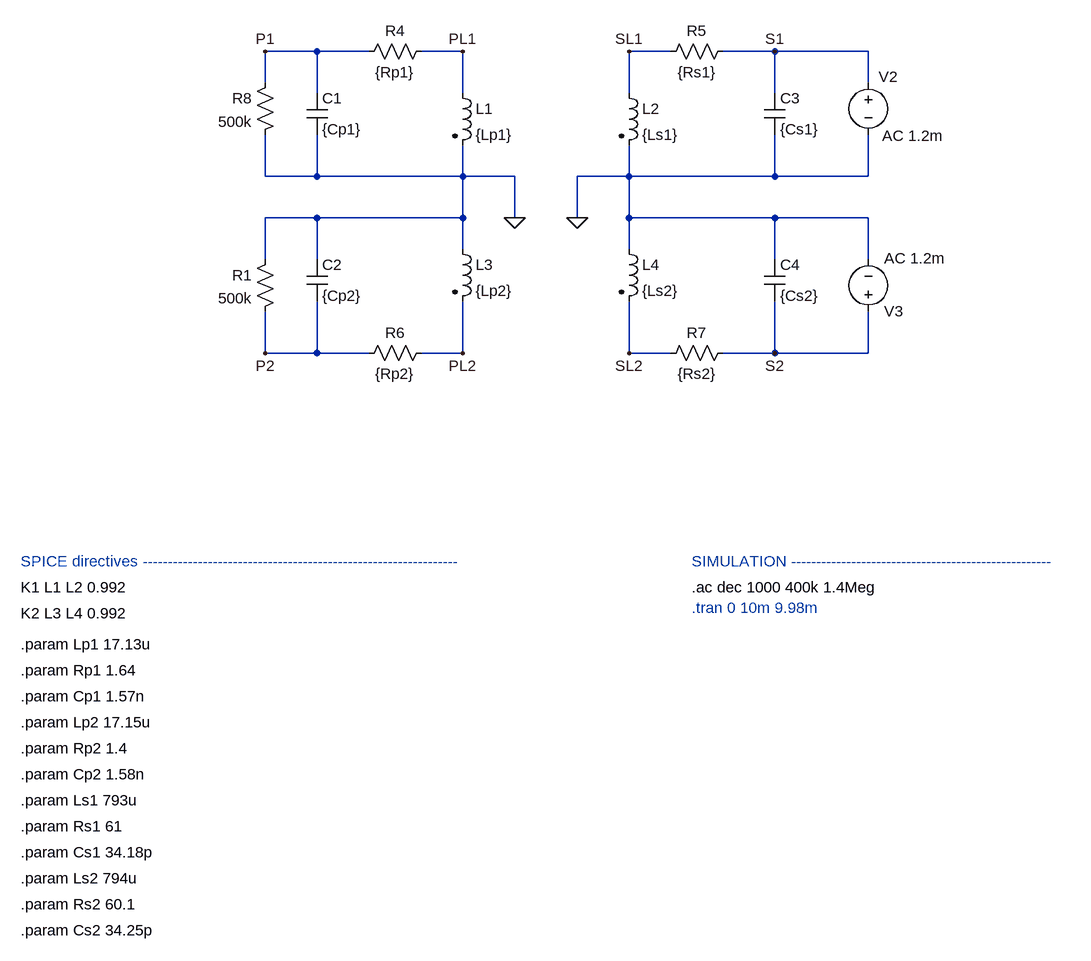
[diagram p0: schematic 1-half_bps_s.asc]
1-half_bps_s.asc, the LTspice schematic file:
Version 4
SHEET 1 1868 1340
WIRE -208 -32 -288 -32
WIRE -128 -32 -208 -32
WIRE 16 -32 -48 -32
WIRE 336 -32 272 -32
WIRE 496 -32 416 -32
WIRE 640 -32 496 -32
WIRE -288 16 -288 -32
WIRE 640 16 640 -32
WIRE -208 32 -208 -32
WIRE 16 32 16 -32
WIRE 272 32 272 -32
WIRE 496 32 496 -32
WIRE -288 160 -288 96
WIRE -208 160 -208 96
WIRE -208 160 -288 160
WIRE 16 160 16 112
WIRE 16 160 -208 160
WIRE 96 160 16 160
WIRE 272 160 272 112
WIRE 272 160 192 160
WIRE 496 160 496 96
WIRE 496 160 272 160
WIRE 640 160 640 96
WIRE 640 160 496 160
WIRE -208 224 -288 224
WIRE 16 224 16 160
WIRE 16 224 -208 224
WIRE 96 224 96 160
WIRE 192 224 192 160
WIRE 272 224 272 160
WIRE 496 224 272 224
WIRE 640 224 496 224
WIRE 16 272 16 224
WIRE 272 272 272 224
WIRE -288 288 -288 224
WIRE -208 288 -208 224
WIRE 496 288 496 224
WIRE 640 288 640 224
WIRE -288 432 -288 368
WIRE -208 432 -208 352
WIRE -208 432 -288 432
WIRE -128 432 -208 432
WIRE 16 432 16 352
WIRE 16 432 -48 432
WIRE 272 432 272 352
WIRE 336 432 272 432
WIRE 496 432 496 352
WIRE 496 432 416 432
WIRE 640 432 640 368
WIRE 640 432 496 432
FLAG 16 -32 PL1
FLAG 272 -32 SL1
FLAG 496 -32 S1
FLAG -288 -32 P1
FLAG 16 432 PL2
FLAG 272 432 SL2
FLAG 496 432 S2
FLAG -288 432 P2
FLAG 96 224 0
FLAG 192 224 0
SYMBOL ind2 0 16 R0
SYMATTR InstName L1
SYMATTR Value {Lp1}
SYMATTR Type ind
SYMBOL ind2 256 16 R0
SYMATTR InstName L2
SYMATTR Value {Ls1}
SYMATTR Type ind
SYMBOL res -32 -48 R90
WINDOW 0 0 56 VBottom 2
WINDOW 3 32 56 VTop 2
SYMATTR InstName R4
SYMATTR Value {Rp1}
SYMBOL res 432 -48 R90
WINDOW 0 0 56 VBottom 2
WINDOW 3 32 56 VTop 2
SYMATTR InstName R5
SYMATTR Value {Rs1}
SYMBOL voltage 640 0 M0
WINDOW 123 -115 98 Left 2
WINDOW 39 0 0 Left 0
WINDOW 0 -45 7 Left 2
SYMATTR Value2 AC 1.2m
SYMATTR InstName V2
SYMATTR Value ""
SYMBOL ind2 0 256 R0
SYMATTR InstName L3
SYMATTR Value {Lp2}
SYMATTR Type ind
SYMBOL ind2 256 256 R0
SYMATTR InstName L4
SYMATTR Value {Ls2}
SYMATTR Type ind
SYMBOL voltage 640 384 M180
WINDOW 123 24 98 Left 2
WINDOW 39 0 0 Left 0
SYMATTR Value2 AC 1.2m
SYMATTR InstName V3
SYMATTR Value ""
SYMBOL res -32 416 R90
WINDOW 0 0 56 VBottom 2
WINDOW 3 32 56 VTop 2
SYMATTR InstName R6
SYMATTR Value {Rp2}
SYMBOL res 432 416 R90
WINDOW 0 0 56 VBottom 2
WINDOW 3 32 56 VTop 2
SYMATTR InstName R7
SYMATTR Value {Rs2}
SYMBOL res -272 0 M0
SYMATTR InstName R8
SYMATTR Value 500k
SYMBOL res -272 272 M0
SYMATTR InstName R1
SYMATTR Value 500k
SYMBOL cap -224 32 R0
SYMATTR InstName C1
SYMATTR Value {Cp1}
SYMBOL cap -224 288 R0
SYMATTR InstName C2
SYMATTR Value {Cp2}
SYMBOL cap 480 32 R0
SYMATTR InstName C3
SYMATTR Value {Cs1}
SYMBOL cap 480 288 R0
SYMATTR InstName C4
SYMATTR Value {Cs2}
TEXT -664 752 Left 2 ;SPICE directives ---------------------------------------------------------------
TEXT 368 792 Left 2 !.ac dec 1000 400k 1.4Meg
TEXT 368 752 Left 2 ;SIMULATION ----------------------------------------------------
TEXT 368 824 Left 2 ;.tran 0 10m 9.98m
TEXT -664 792 Left 2 !K1 L1 L2 0.992
TEXT -664 880 Left 2 !.param Lp1 17.13u
TEXT -664 960 Left 2 !.param Cp1 1.57n
TEXT -664 920 Left 2 !.param Rp1 1.64
TEXT -664 1000 Left 2 !.param Lp2 17.15u
TEXT -664 1080 Left 2 !.param Cp2 1.58n
TEXT -664 1040 Left 2 !.param Rp2 1.4
TEXT -664 1120 Left 2 !.param Ls1 793u
TEXT -664 1200 Left 2 !.param Cs1 34.18p
TEXT -664 1160 Left 2 !.param Rs1 61
TEXT -664 1240 Left 2 !.param Ls2 794u
TEXT -664 1320 Left 2 !.param Cs2 34.25p
TEXT -664 1280 Left 2 !.param Rs2 60.1
TEXT -664 832 Left 2 !K2 L3 L4 0.992

The netlist it stands for:
* 1-half_bps_s.asc
L1 PL1 0 {Lp1}
L2 SL1 0 {Ls1}
R4 PL1 P1 {Rp1}
R5 S1 SL1 {Rs1}
V2 S1 0 AC 1.2m
L3 0 PL2 {Lp2}
L4 0 SL2 {Ls2}
V3 S2 0 AC 1.2m
R6 PL2 P2 {Rp2}
R7 S2 SL2 {Rs2}
R8 P1 0 500k
R1 0 P2 500k
C1 P1 0 {Cp1}
C2 0 P2 {Cp2}
C3 S1 0 {Cs1}
C4 0 S2 {Cs2}
* SPICE directives ---------------------------------------------------------------
.ac dec 1000 400k 1.4Meg
* SIMULATION ----------------------------------------------------
* .tran 0 10m 9.98m
K1 L1 L2 0.992
.param Lp1 17.13u
.param Cp1 1.57n
.param Rp1 1.64
.param Lp2 17.15u
.param Cp2 1.58n
.param Rp2 1.4
.param Ls1 793u
.param Cs1 34.18p
.param Rs1 61
.param Ls2 794u
.param Cs2 34.25p
.param Rs2 60.1
K2 L3 L4 0.992
.backanno
.end